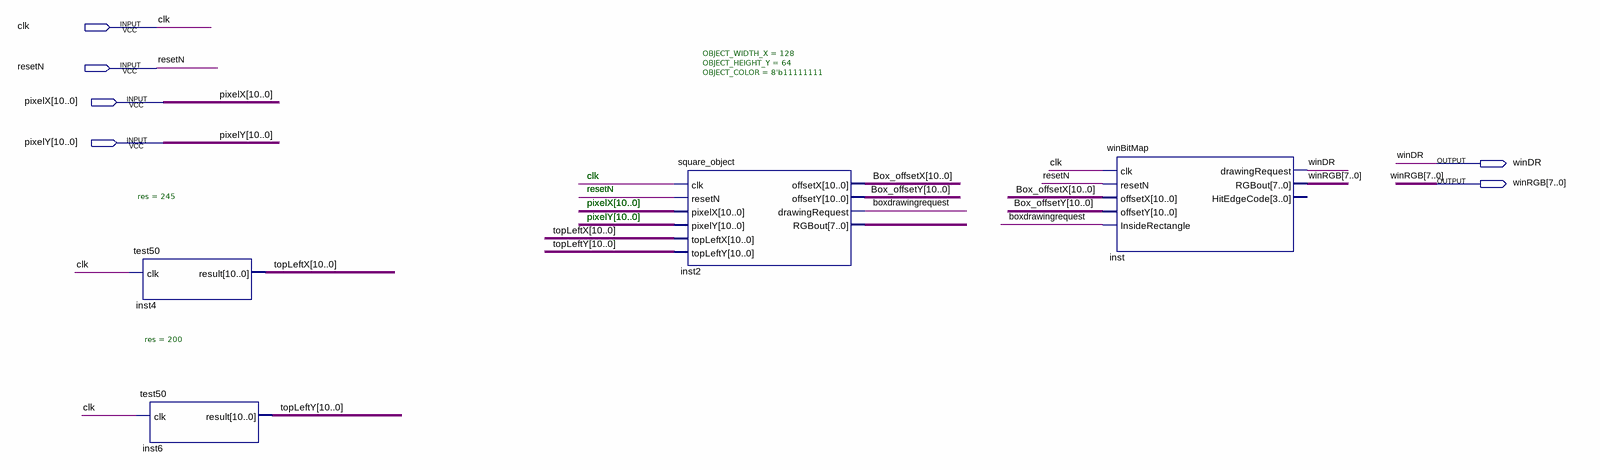
[diagram p0: schematic sheet]
// Quartus schematic win_display.bdf as structural Verilog: 4 symbols, 6 pins
module win_display (
  input  clk,
  input  resetN,
  input  [10:0] pixelX,
  input  [10:0] pixelY,
  output winDR,
  output [7:0] winRGB
);

  wire boxdrawingrequest;
  wire [7:0] inst2_rgbout;
  wire [10:0] Box_offsetX, Box_offsetY, topLeftX, topLeftY;

  test50 #(.res(245)) inst4 (.clk(clk), .result(topLeftX));
  test50 #(.res(200)) inst6 (.clk(clk), .result(topLeftY));
  square_object #(.OBJECT_WIDTH_X(128), .OBJECT_HEIGHT_Y(64), .OBJECT_COLOR(8'b11111111)) inst2 (
    .clk(clk), .resetN(resetN), .pixelX(pixelX), .pixelY(pixelY), .topLeftX(topLeftX), .topLeftY(topLeftY),
    .offsetX(Box_offsetX), .offsetY(Box_offsetY), .drawingRequest(boxdrawingrequest), .RGBout(inst2_rgbout));
  winBitMap inst (
    .clk(clk), .resetN(resetN), .offsetX(Box_offsetX), .offsetY(Box_offsetY),
    .InsideRectangle(boxdrawingrequest), .drawingRequest(winDR), .RGBout(winRGB));  // open: HitEdgeCode

  // Notes on the sheet:
  //   clk
  //   clk
  //   resetN
  //   resetN
  //   pixelX[10..0]
  //   pixelX[10..0]
  //   pixelY[10..0]
  //   pixelY[10..0]
endmodule
